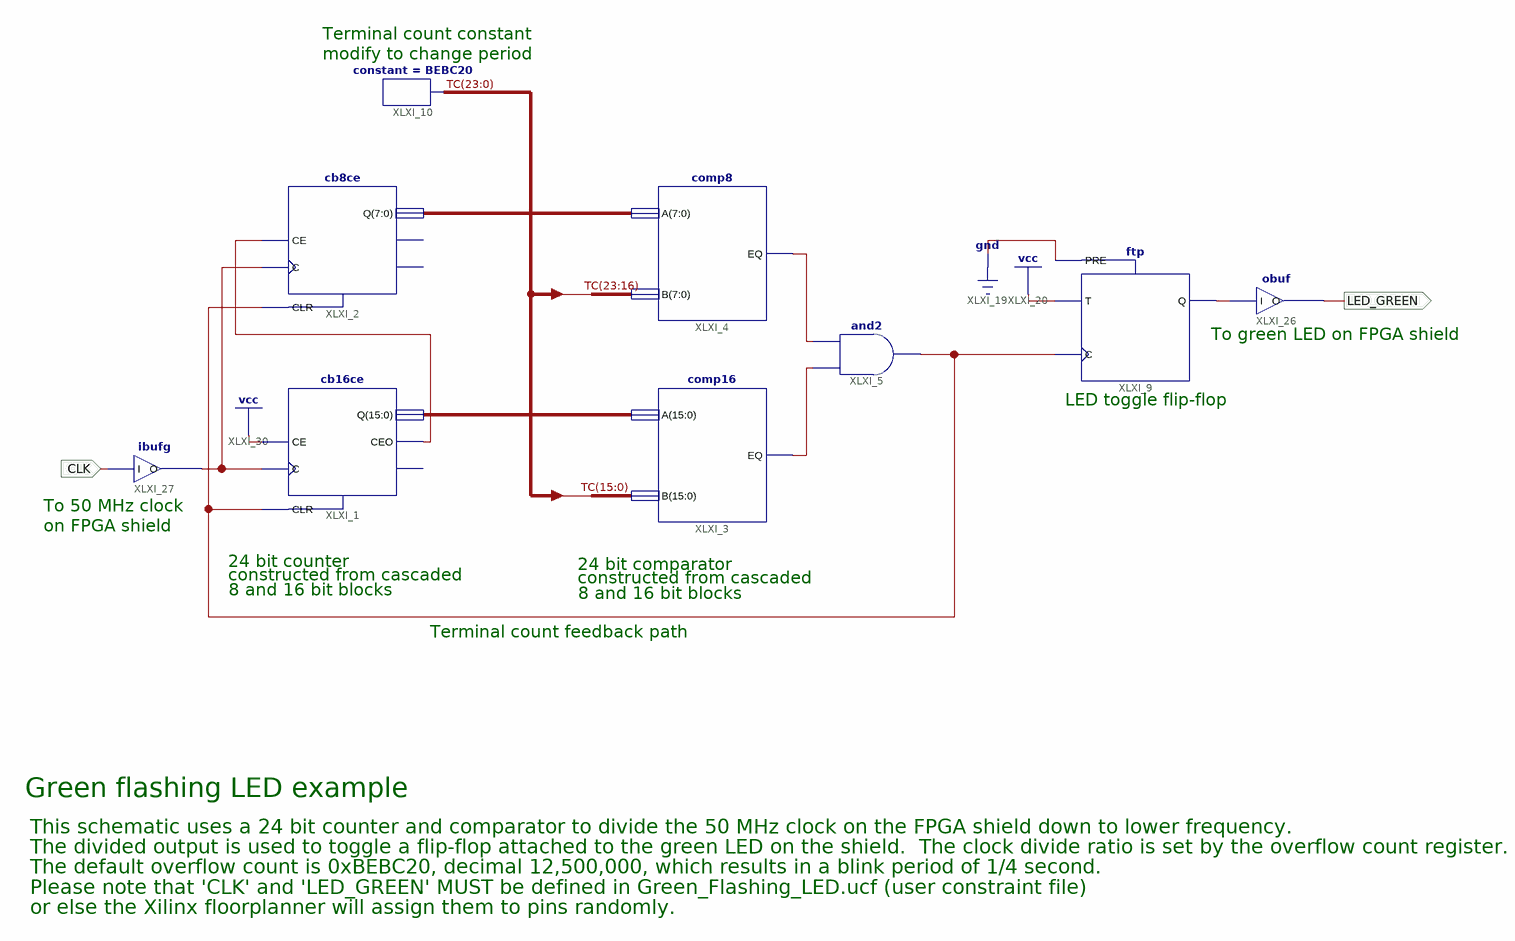
[diagram p0: schematic sheet 1]
// Xilinx ISE schematic Green_Flashing_LED.sch (spartan3a) as structural Verilog: 9 symbols, 2 ports
module Green_Flashing_LED (
  input  CLK,
  output LED_GREEN
);

  wire XLXN_4, XLXN_5, XLXN_6, XLXN_7, XLXN_26, XLXN_31;
  wire [7:0] XLXN_2;
  wire [15:0] XLXN_1;
  wire [23:0] TC;

  comp16 XLXI_3 (.A(XLXN_1), .B(TC[15:0]), .EQ(XLXN_5));
  comp8 XLXI_4 (.A(XLXN_2), .B(TC[23:16]), .EQ(XLXN_4));
  and XLXI_5 (XLXN_31, XLXN_5, XLXN_4);
  constant #(.CValue("BEBC20")) XLXI_10 (.O(TC));
  ftp XLXI_9 (.C(XLXN_31), .PRE(1'b0), .T(1'b1), .Q(XLXN_26));
  obuf XLXI_26 (.I(XLXN_26), .O(LED_GREEN));
  ibufg XLXI_27 (.I(CLK), .O(XLXN_7));
  cb16ce XLXI_1 (.C(XLXN_7), .CE(1'b1), .CLR(XLXN_31), .CEO(XLXN_6), .Q(XLXN_1));  // open: TC
  cb8ce XLXI_2 (.C(XLXN_7), .CE(XLXN_6), .CLR(XLXN_31), .Q(XLXN_2));  // open: CEO, TC

  // Notes on the sheet:
  //   Terminal count constant
  //   modify to change period
  //   To green LED on FPGA shield
  //   LED toggle flip-flop
  //   To 50 MHz clock
  //   on FPGA shield
  //   24 bit counter
  //   24 bit comparator
  //   constructed from cascaded
  //   constructed from cascaded
  //   8 and 16 bit blocks
  //   8 and 16 bit blocks
  //   Terminal count feedback path
  //   Green flashing LED example
  //   This schematic uses a 24 bit counter and comparator to divide the 50 MHz clock on the FPGA shield down to lower frequency.
  //   The divided output is used to toggle a flip-flop attached to the green LED on the shield.  The clock divide ratio is set by the overflow count register.
  //   The default overflow count is 0xBEBC20, decimal 12,500,000, which results in a blink period of 1/4 second.
  //   Please note that 'CLK' and 'LED_GREEN' MUST be defined in Green_Flashing_LED.ucf (user constraint file)
  //   or else the Xilinx floorplanner will assign them to pins randomly.
endmodule
